# EAGLE design untitled (EAGLE 9.4.2)
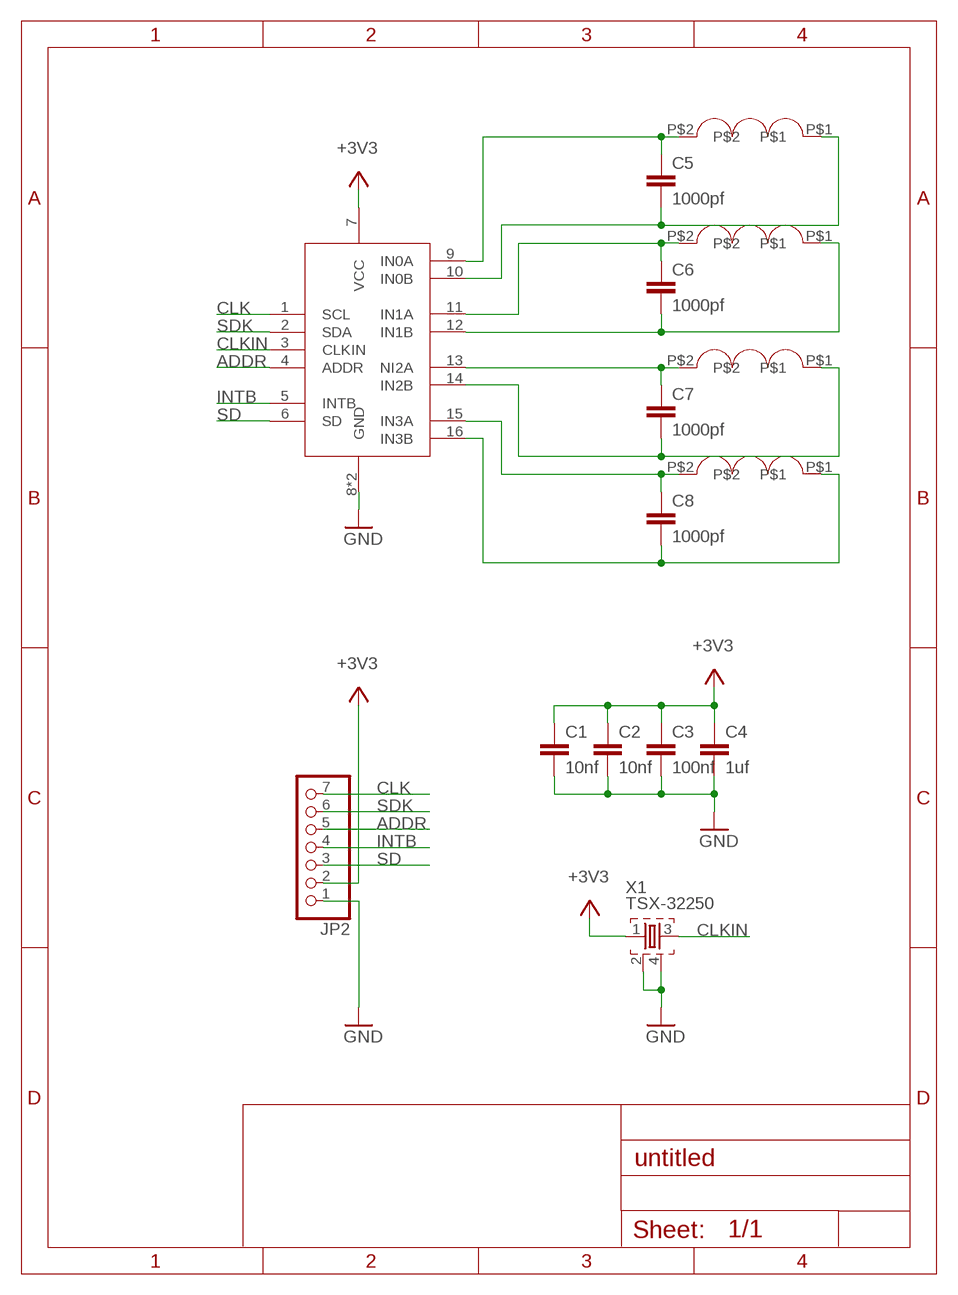
[diagram p0: schematic, sheet 1]

## Parts
C1  10nf  C-EUC0603  [C0603]
C2  10nf  C-EUC0603  [C0603]
C3  100nf  C-EUC0603  [C0603]
C4  1uf  C-EUC0603  [C0603]
C5  1000pf  C-EUC0603  [C0603]
C6  1000pf  C-EUC0603  [C0603]
C7  1000pf  C-EUC0603  [C0603]
C8  1000pf  C-EUC0603  [C0603]
JP2  PINHD-1X7  [1X07]
U$1  LDC1314  [QFN50P400X400X80-17N]
U$2  COIL  [L19.18.2]
U$3  COIL  [L19.18.2]
U$4  COIL  [L19.18.2]
U$5  COIL  [L19.18.2]
X1  TSX-32250  [TSX-3225]

## Nets
+3V3: C1.1 C2.1 C3.1 C4.1 JP2.2 U$1.7(VCC) X1.1
ADDR: JP2.5 U$1.4(ADDR)
CLK: JP2.7 U$1.1(SCL)
CLKIN: U$1.3(CLKIN) X1.3
GND: C1.2 C2.2 C3.2 C4.2 JP2.1 U$1.8(GND) U$1.17(GND) X1.2 X1.4
INTB: JP2.4 U$1.5(INTB)
N$1: C5.2 U$1.10(IN0B) U$2.P$1
N$2: C6.2 U$1.12(IN1B) U$3.P$1
N$3: C7.2 U$1.14(IN2B) U$4.P$1
N$4: C8.2 U$1.16(IN3B) U$5.P$1
N$5: C5.1 U$1.9(IN0A) U$2.P$2
N$6: C6.1 U$1.11(IN1A) U$3.P$2
N$8: C7.1 U$1.13(NI2A) U$4.P$2
N$9: C8.1 U$1.15(IN3A) U$5.P$2
SD: JP2.3 U$1.6(SD)
SDK: JP2.6 U$1.2(SDA)

## Library data of the parts
C1-C8 = rcl:C-EU: CAPACITOR, European symbol; SPICEPREFIX: C
JP2 = pinhead:PINHD-1X7: PIN HEADER
U$1 = LDC:LDC1314
U$2-U$5 = LDC:COIL
X1 = TSX-3225:TSX-3225: MHz RANGE CRYSTAL UNIT Source: Epson Toyocom; AVAILABILITY: Unavailable; DESCRIPTION: 16MHz ±10ppm Crystal 9pF 60 Ohms 4-SMD, No Lead; MF: EPSON; MP: TSX-3225; PACKAGE: SMD-4 Epson; PRICE: None

## Board
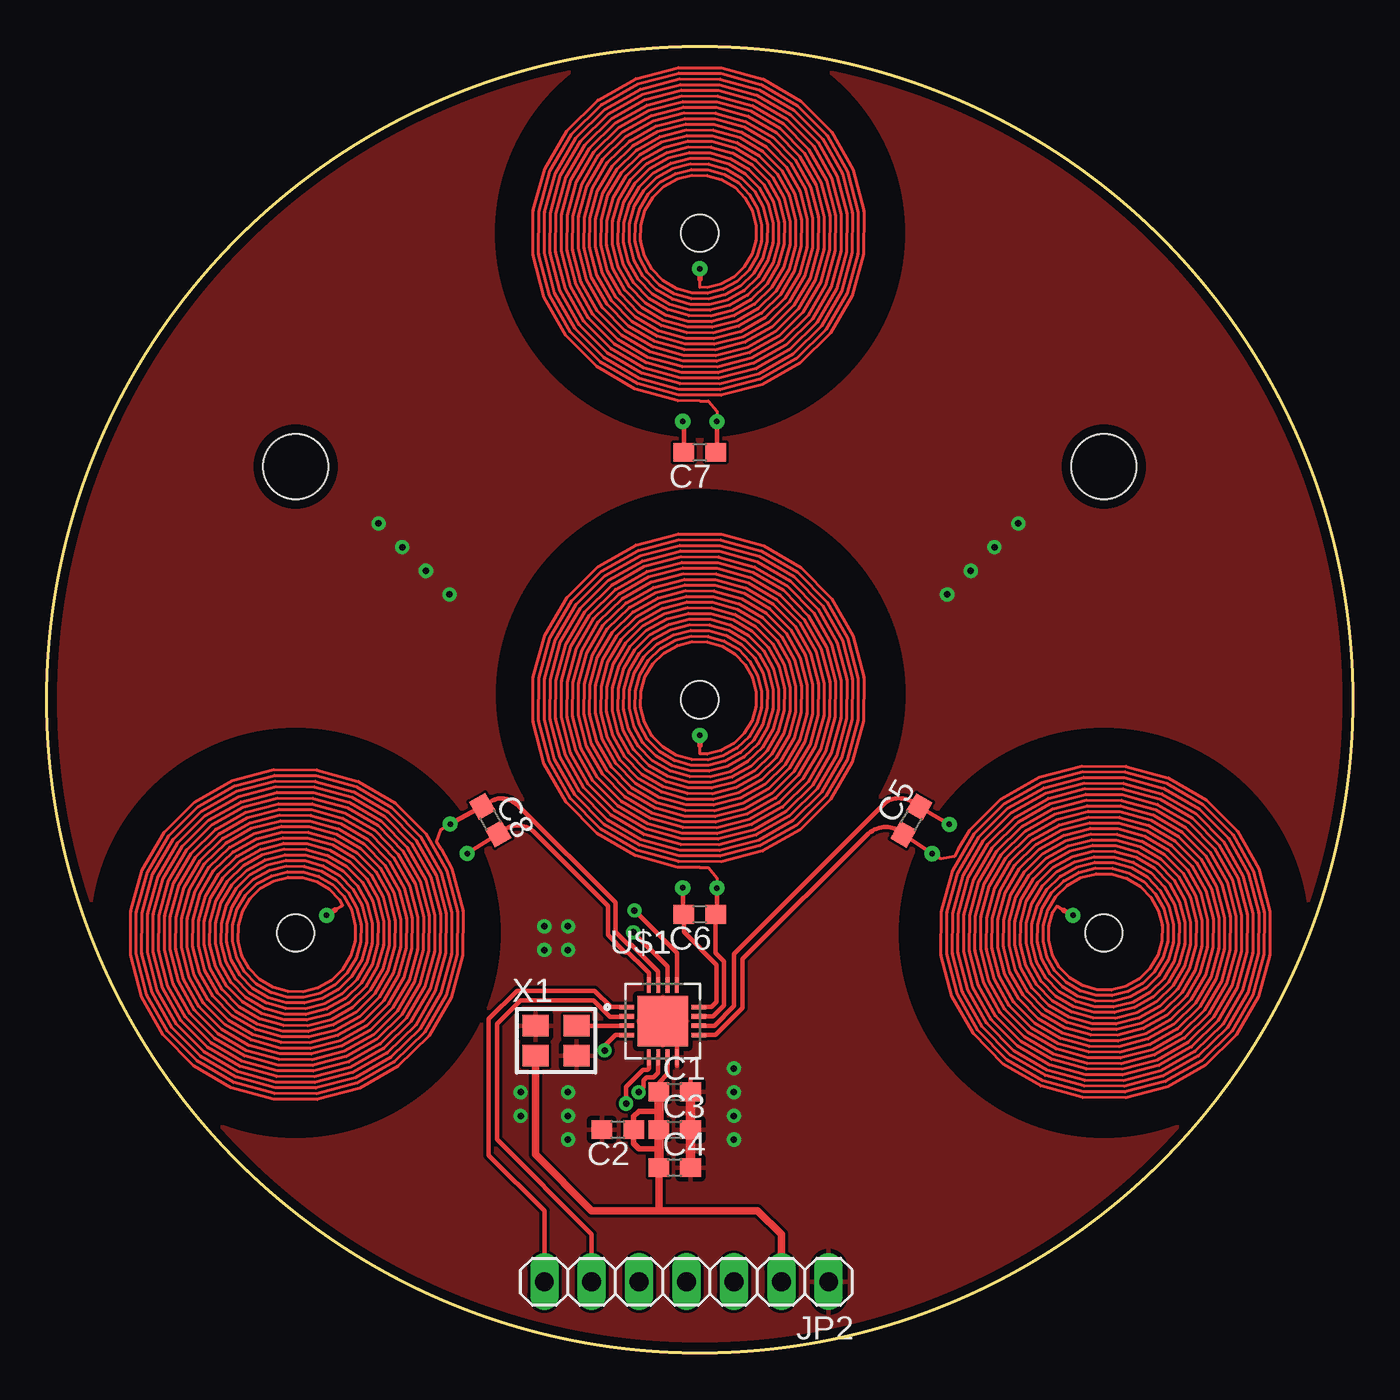
[diagram p1: board, top side]
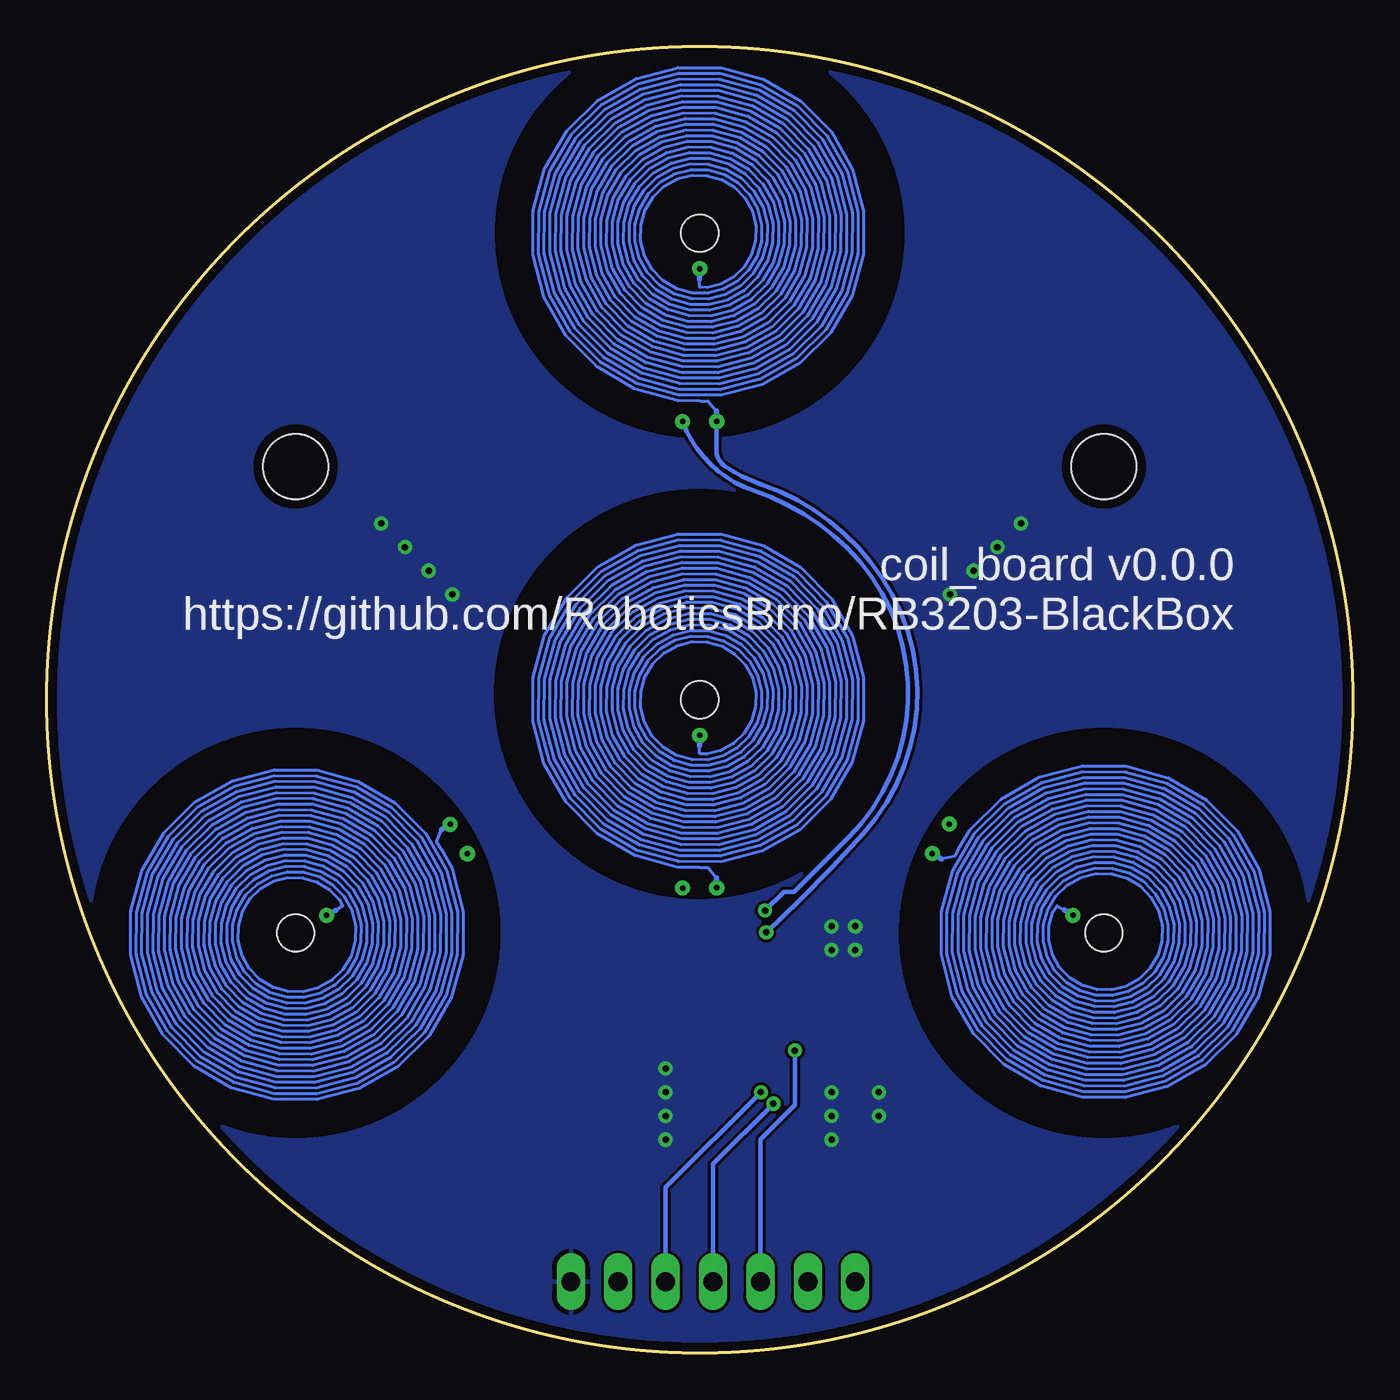
[diagram p2: board, bottom side, seen from below]

Size 70 x 70 mm. Coordinates in mm from the lower left corner, seen from the top.
Outline: circle at 35,35 radius 35
Copper layers (1*16): Top 0.035mm / dielectric 1.5mm / Bottom 0.035mm
Design rules "default *": minimum track width 6mil, minimum drill 0.35mm, track to track 6mil, track to pad 6mil, pad to pad 6mil, via to via 6mil, smd to smd 6mil, copper to edge 0.5mm, drill to drill 6mil, minimum pad ring 10mil, minimum via ring 8mil, stop-mask expansion 4mil, vias tented up to drill 0mil, thermal gap 10mil
Holes 2 mm at 35,35 56.65,22.5 35,60 13.35,22.5
Holes 3.5 mm at 13.35,47.5 56.65,47.5
tRestrict: area 45.8,11.6 to 67.5,33.4; area 2.5,11.6 to 24.2,33.4; area 24.2,24.4 to 45.9,46.2; area 24.2,49.2 to 45.9,70.9
bRestrict: area 2.5,11.6 to 24.2,33.4; area 24.2,24.5 to 45.9,46.2; area 24.1,49.1 to 45.9,70.9; area 45.8,11.6 to 67.5,33.4

### Footprints (pad centres in the part's own frame; a part is rotated, then mirrored left to right if it is on the bottom)
C0603 = smd 1.1 x 1: 1 -0.85,0; 2 0.85,0
1X07 = drill 1.016 long: 1 -7.62,0; 2 -5.08,0; 3 -2.54,0; 4 0,0; 5 2.54,0; 6 5.08,0; 7 7.62,0
QFN50P400X400X80-17N = smd 0.84 x 0.26: 1 -1.935,0.75; 2 -1.935,0.25; 3 -1.935,-0.25; 4 -1.935,-0.75; 9 1.935,-0.75; 10 1.935,-0.25; 11 1.935,0.25; 12 1.935,0.75 | smd 0.26 x 0.84: 5 -0.75,-1.935; 6 -0.25,-1.935; 7 0.25,-1.935; 8 0.75,-1.935; 13 0.75,1.935; 14 0.25,1.935; 15 -0.25,1.935; 16 -0.75,1.935 | smd 2.7 x 2.7: 17 0,0
L19.18.2 = drill 0.3: P$1 -10.081,0.909; P$2 -10.089,-0.917; P$3 -1.905,0
TSX-3225 = smd 1.4 x 1.15: 1 0,-1.6; 2 2.2,-1.6; 3 2.2,0; 4 0,0

### Placement (x,y rotation side)
C1  33.66,13.99 0 top
C2  30.61,11.96 180 top
C3  33.66,11.96 0 top
C4  33.66,9.93 0 top
C5  46.34,28.52 60 top
C6  35,23.5 180 top
C7  35,48.26 180 top
C8  23.77,28.55 300 top
JP2  34.29,3.81 180 top
U$1  33.02,17.78 0 top
U$2  56.65,22.5 330 top
U$3  35,35 90 top
U$4  35,60 90 top
U$5  13.35,22.5 210 top
X1  26.2,17.53 0 top

### Tracks (layer width: path | path; a pad name or v marks a point on that pad's centre or on a via)
+3V3
  Top 0.254: U$1.7 33.27,14.94 32.8,14.48 C1.1
  Top 0.305: 32.8,10.92 31.75,10.92 31.46,11.21 C2.1 31.46,12.66 31.75,12.95 32.8,12.95
  Top 0.406: C4.1 32.8,7.62 | JP2.2 39.37,6.35 38.1,7.62 32.8,7.62 | 32.8,7.62 29.21,7.62 26.2,10.63 X1.1
  Top 0.508: C1.1 32.8,12.95 C3.1 32.8,10.92 C4.1
ADDR  (via drill 0.35)
  Top 0.254: U$1.4 30.48,17.03 29.9,16.45 v29.9,16.2
  Bottom 0.254: JP2.5 31.75,11.43 29.9,13.28 v29.9,16.2
CLK
  Top 0.254: U$1.1 30.25,18.53 29.37,19.41 25.21,19.41 23.69,17.89 23.69,10.6 26.67,7.62 JP2.7
CLKIN
  Top 0.254: U$1.3 X1.3
GND  (via drill 0.35)
  Top 0.254: 33.77,15.38 U$1.8 33.77,17.78 U$1.17 | 34.51,14.64 C1.2
  Top 0.508: C1.2 C3.2 C4.2
  other vias: 27.94,11.43 36.83,11.43 36.83,12.7 36.83,13.97 36.83,15.24 27.94,12.7 27.94,13.97 25.4,12.7 25.4,13.97 17.78,44.45 52.07,44.45 27.94,21.59 26.67,21.59 26.67,22.86 27.94,22.86 19.05,43.18 20.32,41.91 21.59,40.64 50.8,43.18 49.53,41.91 48.26,40.64
  pour Top: -2.54,71.12 -2.54,-1.27 60.96,-1.27 71.12,-1.27 71.12,66.04 71.12,71.12
  pour Bottom: -3.81,72.39 -3.81,-2.54 72.39,-2.54 72.39,72.39
INTB  (via drill 0.35)
  Top 0.254: U$1.5 32.27,15.25 32.2,15.18 31.97,15.18 31.05,14.26 v31.05,13.36
  Bottom 0.254: v31.05,13.36 34.29,10.12 JP2.4
N$1
  Top 0.254: U$2.P$1 C5.2 arc45 45.64,29.73 arc45 44.85,29.4 36.83,21.37 36.83,18.58 35.78,17.53 U$1.10
N$2
  Top 0.254: U$3.P$1 34.09,23.56 C6.2 34.15,22.55 35.9,20.8 35.9,18.8 35.63,18.53 U$1.12
N$3  (via drill 0.35)
  Top 0.152: U$4.P$1 34.15,49.55
  Top 0.254: 34.15,49.55 C7.2 | U$1.14 33.27,20.7 v31.43,22.54
  Bottom 0.254: U$4.P$1 34.11,48.38 arc-57 33.66,47.53 arc-15 31.68,46.54 arc37 25.21,41.51 arc76 26.21,27.84 arc5 v31.43,22.54
N$4
  Top 0.254: U$5.P$1 C8.2 arc-45 25.26,28.26 arc-45 26.14,27.89 30.07,23.96 30.07,22.39 30.99,21.47 31.15,21.47 32.03,20.6 32.27,20.36 U$1.16
N$5
  Top 0.254: U$2.P$2 C5.1 arc45 44.98,28.18 arc45 43.95,27.75 37.3,21.1 37.3,18.48 35.85,17.03 U$1.9
N$6
  Top 0.254: U$3.P$2 35.92,23.57 C6.1 35.85,21.43 36.31,20.97 36.31,18.63 35.7,18.03 U$1.11
N$8  (via drill 0.35)
  Top 0.152: 35.92,48.33 C7.1
  Top 0.254: U$4.P$2 35.92,48.33 | U$1.13 33.77,21.43 v31.5,23.7
  Bottom 0.254: v31.5,23.7 30.5,24.7 29.95,24.7 27.03,27.63 arc-91 27.1,43.15 arc-26 32.1,46.2 arc52 U$4.P$2
N$9
  Top 0.254: U$5.P$2 C8.1 23.9,29.6 arc-40 24.51,29.7 arc-36 25.38,29.23 30.48,24.13 30.48,22.56 31.16,21.88 31.32,21.88 32.77,20.43 U$1.15
SD  (via drill 0.35)
  Top 0.254: v31.72,13.97 31.98,14.22 31.98,14.61 32.14,14.77 32.52,14.77 32.77,15.02 U$1.6
  Bottom 0.254: JP2.3 36.83,8.86 v31.72,13.97
SDK
  Top 0.254: U$1.2 31.05,18 30.2,18 29.3,18.9 25.4,18.9 24.13,17.63 24.13,11.43 29.21,6.35 JP2.6

### Text on the board
bNames: coil_board v0.0.0 / https://github.com/RoboticsBrno/RB3203-BlackBox